# Altium schematic sheet SDcard.SchDoc
size A; SheetNumber: 10; SheetTotal: 12
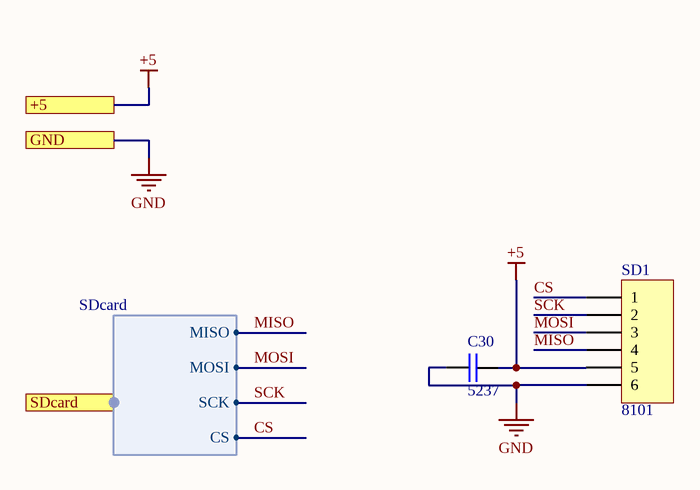
[diagram p0: SDcard.SchDoc]

## Parts
C30  Inflow: 5237  [CAP 1206/3216]  (hidden comment: 1u'F, 50'V)
SD1  Inflow: 8101  [HDR_THT_6F_2.54mm]  (hidden comment: 6)

## Ports
+5, GND, SDcard (harness SDcard)

## Harnesses
SDcard: MISO, MOSI, SCK, CS

## Nets
+5: C30.2 SD1.5 ; port +5
GND: C30.1 SD1.6 ; port GND
CS: SD1.1 ; port SDcard.CS
MISO: SD1.4 ; port SDcard.MISO
MOSI: SD1.3 ; port SDcard.MOSI
SCK: SD1.2 ; port SDcard.SCK

## Library data of the parts
C30 = Cap_Multi_1u_50_1206: Bipolar ceramic capacitor SMD; Rating: Rating?; Type: Type?; Validation: Valid; Value: 1u'F, 50'V; Package: Package?
SD1 = Con_FPH_6x1_V_THT_2.54: Header, single row, 6 pin; Rating: Rating?; Validation: NT; Value: 6; Package: Package?; Type: Type?